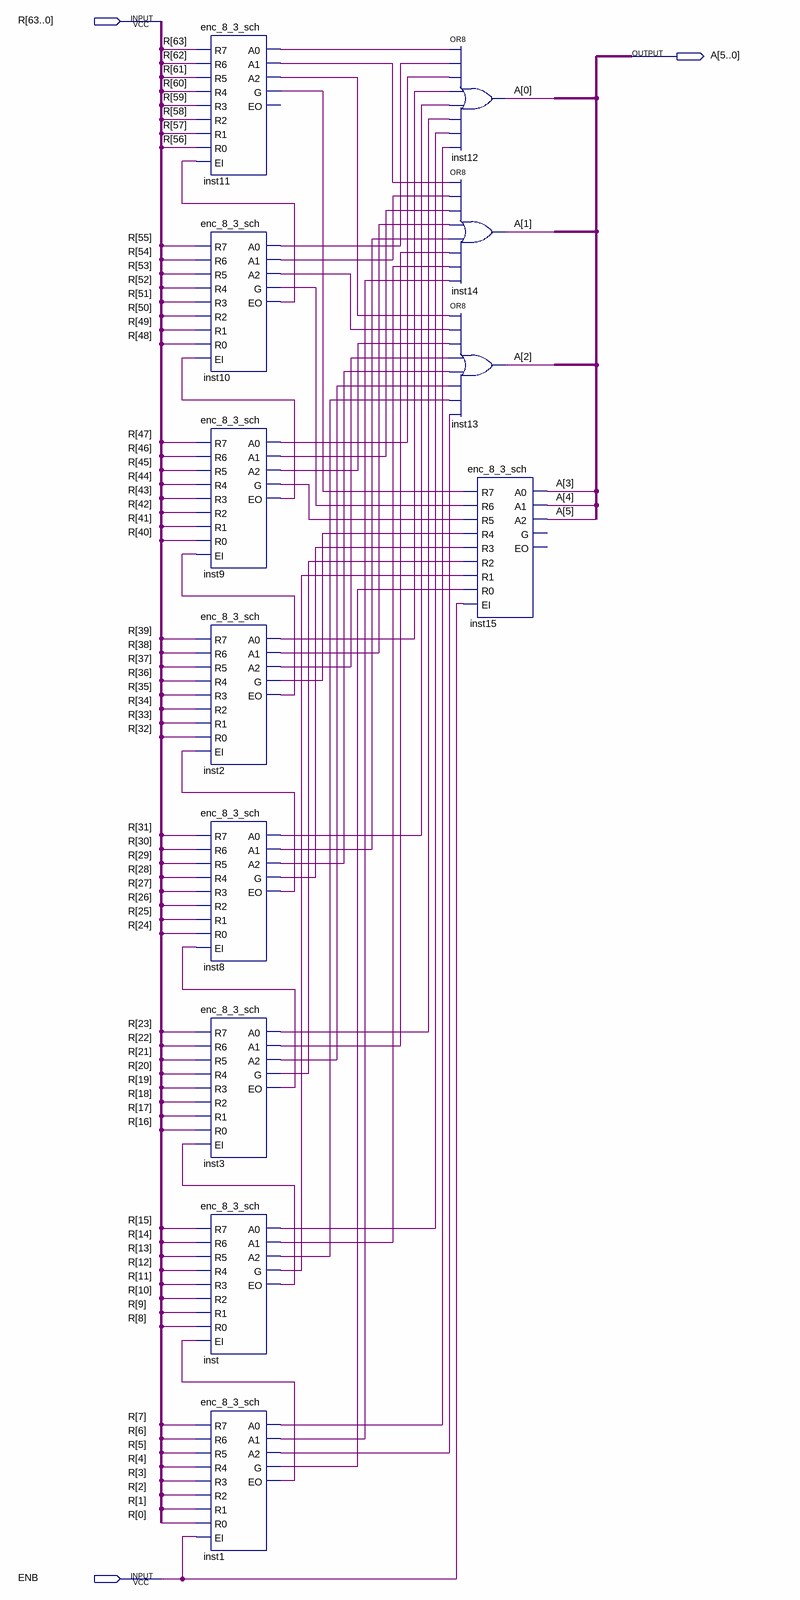
[diagram p0: schematic sheet]
// Quartus schematic enc_64_6_sch.bdf as structural Verilog: 12 symbols, 3 pins
module enc_64_6_sch (
  input  [63:0] R,
  input  ENB,
  output [5:0] A
);

  wire inst1_a0, inst1_a1, inst1_a2, inst1_eo, inst1_g, inst2_a0, inst2_a1, inst2_a2, inst2_eo, inst2_g,
       inst3_a0, inst3_a1, inst3_a2, inst3_eo, inst3_g, inst8_a0, inst8_a1, inst8_a2, inst8_eo, inst8_g,
       inst9_a0, inst9_a1, inst9_a2, inst9_eo, inst9_g, inst10_a0, inst10_a1, inst10_a2, inst10_eo, inst10_g,
       inst11_a0, inst11_a1, inst11_a2, inst11_g, inst_a0, inst_a1, inst_a2, inst_eo, inst_g;

  enc_8_3_sch inst11 (
    .R7(R[63]), .R6(R[62]), .R5(R[61]), .R4(R[60]), .R3(R[59]), .R2(R[58]), .R1(R[57]), .R0(R[56]),
    .EI(inst10_eo), .A0(inst11_a0), .A1(inst11_a1), .A2(inst11_a2), .G(inst11_g));  // open: EO
  enc_8_3_sch inst10 (
    .R7(R[55]), .R6(R[54]), .R5(R[53]), .R4(R[52]), .R3(R[51]), .R2(R[50]), .R1(R[49]), .R0(R[48]),
    .EI(inst9_eo), .A0(inst10_a0), .A1(inst10_a1), .A2(inst10_a2), .G(inst10_g), .EO(inst10_eo));
  enc_8_3_sch inst9 (
    .R7(R[47]), .R6(R[46]), .R5(R[45]), .R4(R[44]), .R3(R[43]), .R2(R[42]), .R1(R[41]), .R0(R[40]),
    .EI(inst2_eo), .A0(inst9_a0), .A1(inst9_a1), .A2(inst9_a2), .G(inst9_g), .EO(inst9_eo));
  enc_8_3_sch inst2 (
    .R7(R[39]), .R6(R[38]), .R5(R[37]), .R4(R[36]), .R3(R[35]), .R2(R[34]), .R1(R[33]), .R0(R[32]),
    .EI(inst8_eo), .A0(inst2_a0), .A1(inst2_a1), .A2(inst2_a2), .G(inst2_g), .EO(inst2_eo));
  enc_8_3_sch inst8 (
    .R7(R[31]), .R6(R[30]), .R5(R[29]), .R4(R[28]), .R3(R[27]), .R2(R[26]), .R1(R[25]), .R0(R[24]),
    .EI(inst3_eo), .A0(inst8_a0), .A1(inst8_a1), .A2(inst8_a2), .G(inst8_g), .EO(inst8_eo));
  enc_8_3_sch inst3 (
    .R7(R[23]), .R6(R[22]), .R5(R[21]), .R4(R[20]), .R3(R[19]), .R2(R[18]), .R1(R[17]), .R0(R[16]),
    .EI(inst_eo), .A0(inst3_a0), .A1(inst3_a1), .A2(inst3_a2), .G(inst3_g), .EO(inst3_eo));
  enc_8_3_sch inst (
    .R7(R[15]), .R6(R[14]), .R5(R[13]), .R4(R[12]), .R3(R[11]), .R2(R[10]), .R1(R[9]), .R0(R[8]),
    .EI(inst1_eo), .A0(inst_a0), .A1(inst_a1), .A2(inst_a2), .G(inst_g), .EO(inst_eo));
  enc_8_3_sch inst1 (
    .R7(R[7]), .R6(R[6]), .R5(R[5]), .R4(R[4]), .R3(R[3]), .R2(R[2]), .R1(R[1]), .R0(R[0]), .EI(ENB),
    .A0(inst1_a0), .A1(inst1_a1), .A2(inst1_a2), .G(inst1_g), .EO(inst1_eo));
  or inst12 (A[0], inst11_a0, inst10_a0, inst9_a0, inst2_a0, inst8_a0, inst3_a0, inst_a0, inst1_a0);
  or inst14 (A[1], inst11_a1, inst10_a1, inst9_a1, inst2_a1, inst8_a1, inst3_a1, inst_a1, inst1_a1);
  or inst13 (A[2], inst11_a2, inst10_a2, inst9_a2, inst2_a2, inst8_a2, inst3_a2, inst_a2, inst1_a2);
  enc_8_3_sch inst15 (
    .R7(inst11_g), .R6(inst10_g), .R5(inst9_g), .R4(inst2_g), .R3(inst8_g), .R2(inst3_g), .R1(inst_g),
    .R0(inst1_g), .EI(ENB), .A0(A[3]), .A1(A[4]), .A2(A[5]));  // open: G, EO
endmodule
